# Altium schematic sheet DSO_ADC.SchDoc: Schematic_Name
size A4; CompanyName: University of Melbourne; Engineer: Your Name Here; DocumentNumber: 1; Revision: 0.1; SheetNumber: 1; SheetTotal: 1; Title_Project: Project_Title; StudentNo: Student No.
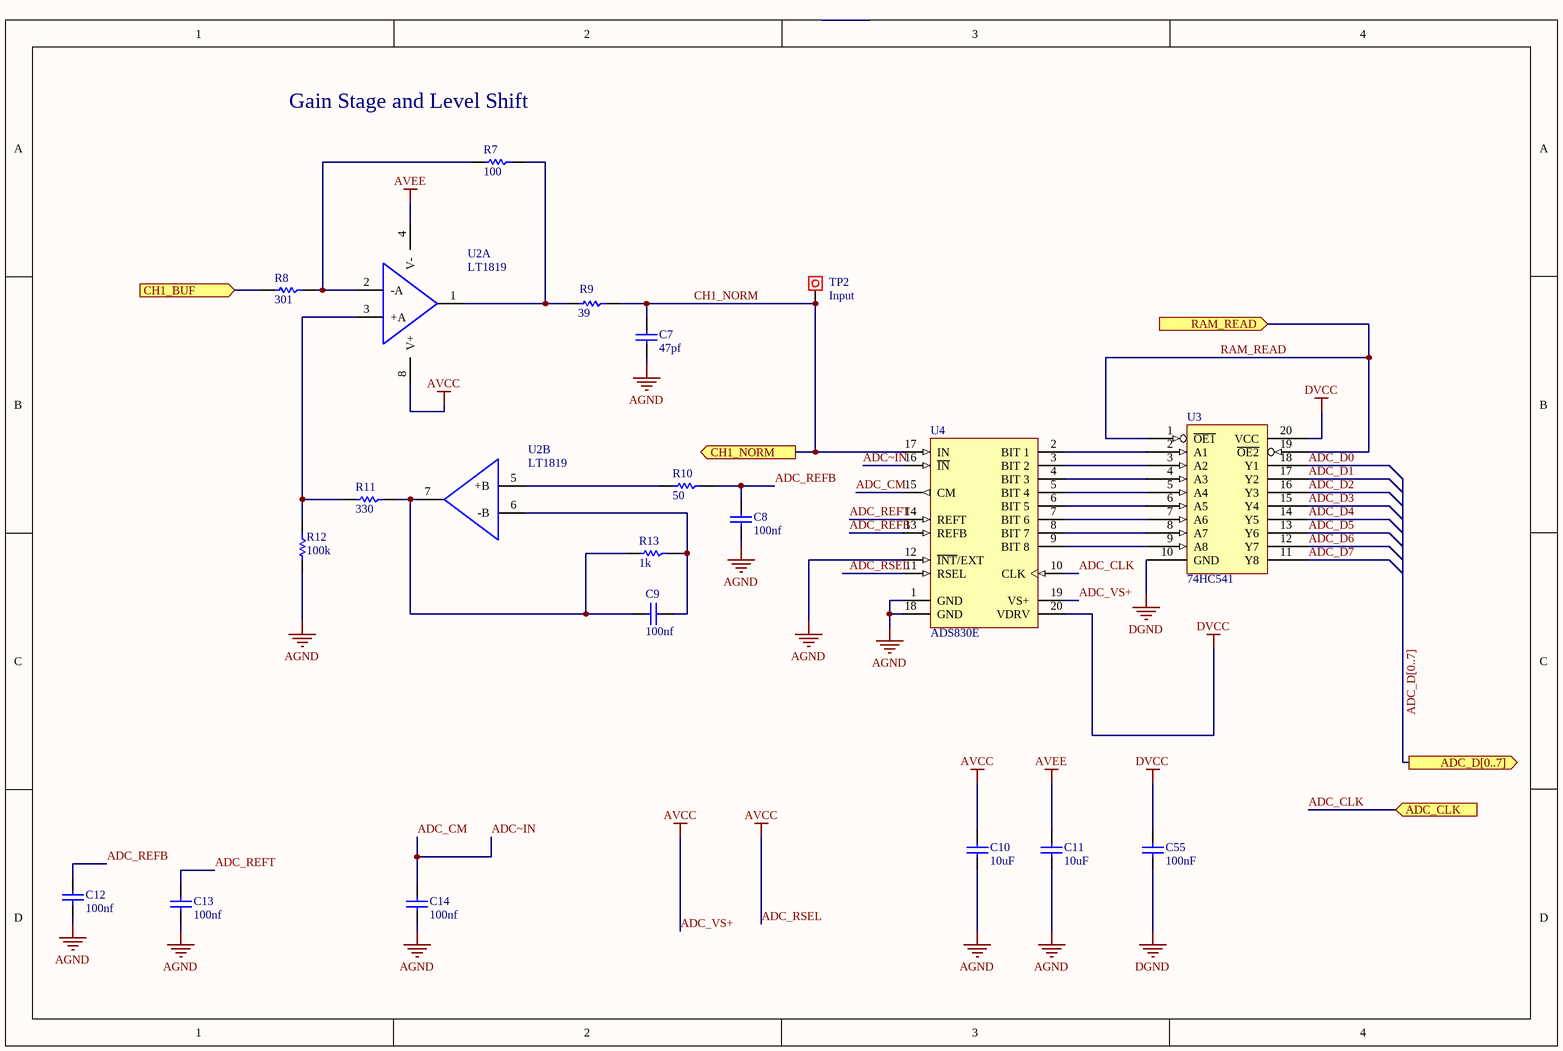
[diagram p0: DSO_ADC.SchDoc]

## Parts
C7  47pf  [0805C]
C8  100nf  [0805C]
C9  100nf  [0805C]
C10  10uF  [0805C]
C11  10uF  [0805C]
C12  100nf  [0805C]
C13  100nf  [0805C]
C14  100nf  [0805C]
C55  100nF  [0805C]
R7  100  [0805]
R8  301  [0805]
R9  39  [0805]
R10  50  [0805]
R11  330  [0805]
R12  100k  [0805]
R13  1k  [0805]
TP2  INPUT  [Testpoin]
U2  LT1819  [MSOP-8]  (parts A,B of 2)
U3  74HC541  [SOT163-1_N]
U4  ADS830E  [TI-DBQ20_L]

## Ports
ADC_CLK (in), ADC_D[0..7] (out), CH1_BUF (in), CH1_NORM (out), RAM_READ (in)

## Nets
ADC_RSEL: C10.1 U2.8(V+) U4.11(RSEL) U4.19(VS+)  [also labelled ADC_VS+, AVCC]
AGND: C7.2 C8.1 C10.2 C11.2 C12.1 C13.1 C14.1 R12.2 U4.1(GND) U4.12(~{INT}/EXT) U4.18(GND)
AVEE: C11.1 U2.4(V-)
DGND: C55.2 U3.10(GND)
DVCC: C55.1 U3.20(VCC) U4.20(VDRV)
ADC_CLK: U4.10(CLK) ; port ADC_CLK
ADC_CM: C14.2 U4.15(CM) U4.16(~{IN})  [also labelled ADC~IN]
ADC_D0: U3.18(Y1)
ADC_D1: U3.17(Y2)
ADC_D2: U3.16(Y3)
ADC_D3: U3.15(Y4)
ADC_D4: U3.14(Y5)
ADC_D5: U3.13(Y6)
ADC_D6: U3.12(Y7)
ADC_D7: U3.11(Y8)
ADC_REFB: C8.2 C12.2 R10.1 U4.13(REFB)
ADC_REFT: C13.2 U4.14(REFT)
CH1_BUF: R8.2 ; port CH1_BUF
CH1_NORM: C7.1 R9.1 TP2.1 U4.17(IN) ; port CH1_NORM
RAM_READ: U3.1(~{OE1}) U3.19(~{OE2}) ; port RAM_READ
NetC9_1: C9.1 R11.1 R13.2 U2.7(OUTB)
NetC9_2: C9.2 R13.1 U2.6(-B)
NetR7_1: R7.1 R9.2 U2.1(OUTA)
NetR7_2: R7.2 R8.1 U2.2(-A)
NetR10_2: R10.2 U2.5(+B)
NetR11_2: R11.2 R12.1 U2.3(+A)
NetU3_2: U3.2(A1) U4.2(BIT_1)
NetU3_3: U3.3(A2) U4.3(BIT_2)
NetU3_4: U3.4(A3) U4.4(BIT_3)
NetU3_5: U3.5(A4) U4.5(BIT_4)
NetU3_6: U3.6(A5) U4.6(BIT_5)
NetU3_7: U3.7(A6) U4.7(BIT_6)
NetU3_8: U3.8(A7) U4.8(BIT_7)
NetU3_9: U3.9(A8) U4.9(BIT_8)

## Buses and harness runs
bus ADC_D[0..7] = port ADC_D[0..7]

## Notes on the sheet
- (near R7) Gain Stage and Level Shift

## Library data of the parts
C7-C14 C55 = C: Capacitor; Reviewed by: RM - 2018/08/05; Revision: July-2002: Re-released for DXP Platform.; Supplier 1: *; Supplier Part Number 1: *
  C7: Value: 47pf
  C8 C9 C12-C14: Value: 100nf
  C10 C11: Value: 10uF
  C55: Value: 100nF
R7-R13 = R: Resistor; Reviewed by: RM - 2018/08/05; Supplier 1: *; Suppler Part Number 1: *
  R7: Value: 100
  R8: Value: 301
  R9: Value: 39
  R10: Value: 50
  R11: Value: 330
  R12: Value: 100k
  R13: Value: 1k
TP2 = Test Point: Pad; Value: Input
U2 = LT1819: OpAmp High Frequency Dual; Reviewed by: RM - 2018/08/05; Supplier 1: Digi-Key; Supplier Part Number 1: LT1819CMS8#PBF-ND
U3 = 74HC541: (ADV) Octal Buffer, Line Driver; Reviewed by: RM - 2018/08/05; Supplier 1: Digi-Key; Supplier Part Number 1: 296-1202-1-ND
U4 = ADS830E: 8-Bit, 60 MSPS ADC Single-Ended / Differential Input, Internal / External Reference and Programmble Input Range, -40 to 85 degC, 20-pin SOP (DBQ20), Green (RoHS & no Sb/Br); Reviewed by: RM - 2018/08/05; ComponentLink2URL: http://www.ti.com/general/docs/lit/getliterature.tsp?genericPartNumber=ADS830&fileType=pdf; ComponentLink2Description: Datasheet; ComponentLink1URL: http://www.ti.com/; ComponentLink3URL: http://www.ti.com/litv/pdf/mpds210a; ComponentLink3Description: Package Specification; ComponentLink1Description: Manufacturer URL; Supplier 1: Digi-Key; Supplier Part Number 1: ADS830E-ND